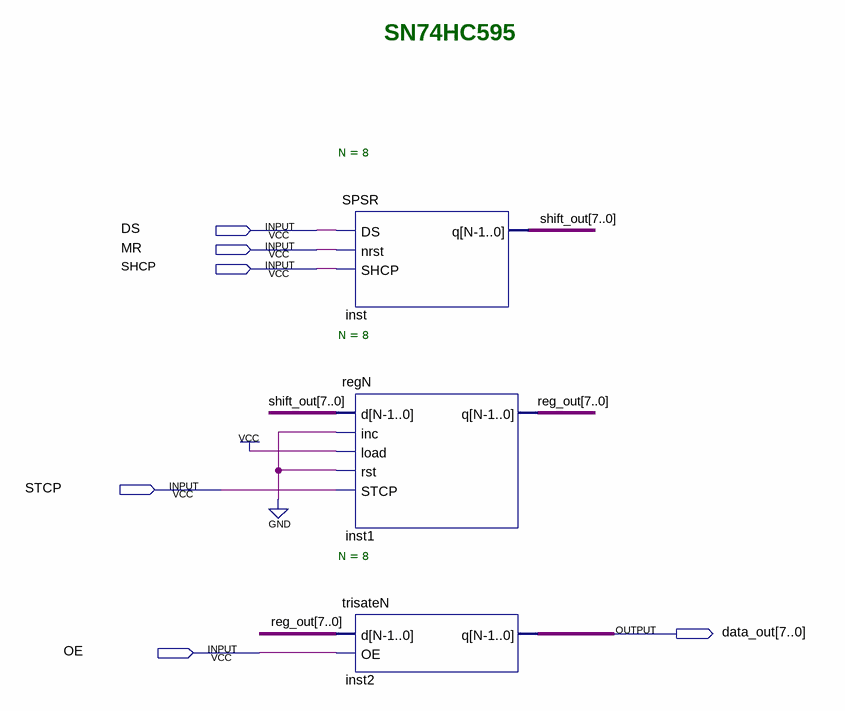
[diagram p0: schematic sheet]
// Quartus schematic SN74HC595.bdf as structural Verilog: 3 symbols, 6 pins
module SN74HC595 (
  input  DS,
  input  MR,
  input  SHCP,
  input  STCP,
  input  OE,
  output [7:0] data_out
);

  wire [7:0] reg_out, shift_out;

  SPSR #(.N(8)) inst (.DS(DS), .nrst(MR), .SHCP(SHCP), .q(shift_out));
  regN #(.N(8)) inst1 (.d(shift_out), .inc(1'b0), .load(1'b1), .rst(1'b0), .STCP(STCP), .q(reg_out));
  trisateN #(.N(8)) inst2 (.d(reg_out), .OE(OE), .q(data_out));

  // Notes on the sheet:
  //   SN74HC595
endmodule
